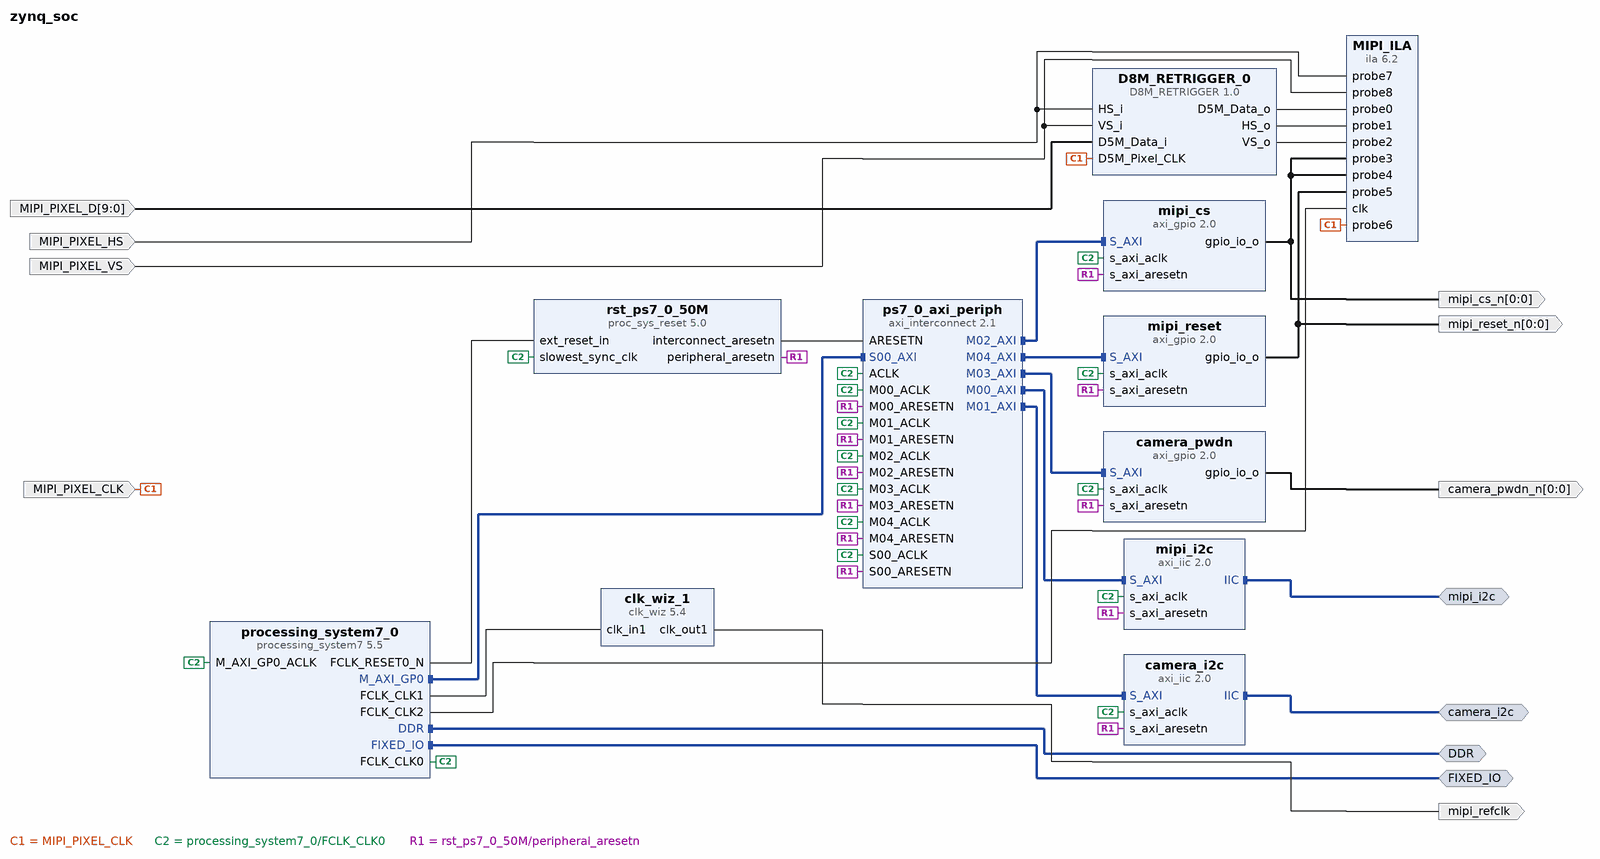
[diagram p0: block diagram of the top level]
# Vivado block design zynq_soc, xc7z020clg484-1, Vivado 2017.2
create_bd_design zynq_soc

create_bd_intf_port -mode Master -vlnv xilinx.com:interface:ddrx_rtl:1.0 DDR
create_bd_intf_port -mode Master -vlnv xilinx.com:display_processing_system7:fixedio_rtl:1.0 FIXED_IO
create_bd_intf_port -mode Master -vlnv xilinx.com:interface:iic_rtl:1.0 camera_i2c
create_bd_intf_port -mode Master -vlnv xilinx.com:interface:iic_rtl:1.0 mipi_i2c
create_bd_port -dir I -type clk MIPI_PIXEL_CLK
create_bd_port -dir I -from 9 -to 0 -type data MIPI_PIXEL_D
create_bd_port -dir I MIPI_PIXEL_HS
create_bd_port -dir I MIPI_PIXEL_VS
create_bd_port -dir O -from 0 -to 0 camera_pwdn_n
create_bd_port -dir O mipi_refclk
create_bd_port -dir O -from 0 -to 0 mipi_cs_n
create_bd_port -dir O -from 0 -to 0 mipi_reset_n

create_bd_cell -type ip -vlnv xilinx.com:user:D8M_RETRIGGER:1.0 D8M_RETRIGGER_0
create_bd_cell -type ip -vlnv xilinx.com:ip:ila:6.2 MIPI_ILA
set_property -dict [list \
  CONFIG.C_PROBE0_WIDTH 12 \
  CONFIG.C_DATA_DEPTH 8192 \
  CONFIG.C_NUM_OF_PROBES 9 \
  CONFIG.C_ENABLE_ILA_AXI_MON false \
  CONFIG.C_MONITOR_TYPE Native \
] [get_bd_cells MIPI_ILA]
create_bd_cell -type ip -vlnv xilinx.com:ip:axi_iic:2.0 camera_i2c
create_bd_cell -type ip -vlnv xilinx.com:ip:axi_gpio:2.0 camera_pwdn
set_property -dict [list \
  CONFIG.C_GPIO_WIDTH 1 \
  CONFIG.C_ALL_INPUTS 0 \
  CONFIG.C_DOUT_DEFAULT 0x00000001 \
  CONFIG.USE_BOARD_FLOW true \
  CONFIG.GPIO_BOARD_INTERFACE Custom \
  CONFIG.C_ALL_OUTPUTS 1 \
] [get_bd_cells camera_pwdn]
create_bd_cell -type ip -vlnv xilinx.com:ip:clk_wiz:5.4 clk_wiz_1
set_property -dict [list \
  CONFIG.PRIM_IN_FREQ 50.000 \
  CONFIG.CLKIN1_JITTER_PS 200.0 \
  CONFIG.CLKOUT1_REQUESTED_OUT_FREQ 20.00 \
  CONFIG.USE_LOCKED false \
  CONFIG.USE_RESET false \
  CONFIG.MMCM_DIVCLK_DIVIDE 1 \
  CONFIG.MMCM_CLKFBOUT_MULT_F 20.000 \
  CONFIG.MMCM_CLKIN1_PERIOD 20.000 \
  CONFIG.MMCM_CLKIN2_PERIOD 10.0 \
  CONFIG.MMCM_CLKOUT0_DIVIDE_F 50.000 \
  CONFIG.USE_BOARD_FLOW true \
  CONFIG.CLK_IN1_BOARD_INTERFACE Custom \
  CONFIG.CLKOUT1_JITTER 249.363 \
  CONFIG.CLKOUT1_PHASE_ERROR 164.985 \
] [get_bd_cells clk_wiz_1]
create_bd_cell -type ip -vlnv xilinx.com:ip:axi_gpio:2.0 mipi_cs
set_property -dict [list \
  CONFIG.C_GPIO_WIDTH 1 \
  CONFIG.C_ALL_INPUTS 0 \
  CONFIG.USE_BOARD_FLOW true \
  CONFIG.GPIO_BOARD_INTERFACE Custom \
  CONFIG.C_ALL_OUTPUTS 1 \
] [get_bd_cells mipi_cs]
create_bd_cell -type ip -vlnv xilinx.com:ip:axi_iic:2.0 mipi_i2c
create_bd_cell -type ip -vlnv xilinx.com:ip:axi_gpio:2.0 mipi_reset
set_property -dict [list \
  CONFIG.C_GPIO_WIDTH 1 \
  CONFIG.C_ALL_INPUTS 0 \
  CONFIG.C_DOUT_DEFAULT 0x00000001 \
  CONFIG.USE_BOARD_FLOW true \
  CONFIG.GPIO_BOARD_INTERFACE Custom \
  CONFIG.C_ALL_OUTPUTS 1 \
] [get_bd_cells mipi_reset]
create_bd_cell -type ip -vlnv xilinx.com:ip:processing_system7:5.5 processing_system7_0
set_property -dict [list \
  CONFIG.PCW_FPGA0_PERIPHERAL_FREQMHZ 50 \
  CONFIG.PCW_FPGA1_PERIPHERAL_FREQMHZ 50 \
  CONFIG.PCW_FPGA2_PERIPHERAL_FREQMHZ 100 \
  CONFIG.PCW_EN_CLK1_PORT 1 \
  CONFIG.PCW_EN_CLK2_PORT 1 \
  CONFIG.PCW_QSPI_GRP_SINGLE_SS_ENABLE 1 \
  CONFIG.PCW_ENET0_PERIPHERAL_ENABLE 0 \
  CONFIG.PCW_USB0_PERIPHERAL_ENABLE 0 \
  CONFIG.preset ZedBoard \
] [get_bd_cells processing_system7_0]
# 2 more settings of processing_system7_0 are not shown: defaults, MIO pin electricals, DDR timing, and values the tool derives
create_bd_cell -type ip -vlnv xilinx.com:ip:axi_interconnect:2.1 ps7_0_axi_periph
set_property -dict {CONFIG.NUM_MI 5} [get_bd_cells ps7_0_axi_periph]
create_bd_cell -type ip -vlnv xilinx.com:ip:proc_sys_reset:5.0 rst_ps7_0_50M

# ---- connections ----

connect_bd_intf_net [get_bd_intf_pins processing_system7_0/M_AXI_GP0] [get_bd_intf_pins ps7_0_axi_periph/S00_AXI]
connect_bd_intf_net [get_bd_intf_pins mipi_i2c/S_AXI] [get_bd_intf_pins ps7_0_axi_periph/M00_AXI]
connect_bd_intf_net [get_bd_intf_pins camera_i2c/S_AXI] [get_bd_intf_pins ps7_0_axi_periph/M01_AXI]
connect_bd_intf_net [get_bd_intf_pins mipi_cs/S_AXI] [get_bd_intf_pins ps7_0_axi_periph/M02_AXI]
connect_bd_intf_net [get_bd_intf_pins camera_pwdn/S_AXI] [get_bd_intf_pins ps7_0_axi_periph/M03_AXI]
connect_bd_intf_net [get_bd_intf_pins mipi_reset/S_AXI] [get_bd_intf_pins ps7_0_axi_periph/M04_AXI]
connect_bd_intf_net [get_bd_intf_ports DDR] [get_bd_intf_pins processing_system7_0/DDR]
connect_bd_intf_net [get_bd_intf_ports FIXED_IO] [get_bd_intf_pins processing_system7_0/FIXED_IO]
connect_bd_intf_net -intf_net axi_iic_0_IIC1 [get_bd_intf_ports camera_i2c] [get_bd_intf_pins camera_i2c/IIC]
connect_bd_intf_net -intf_net axi_iic_0_IIC [get_bd_intf_ports mipi_i2c] [get_bd_intf_pins mipi_i2c/IIC]
connect_bd_net [get_bd_pins D8M_RETRIGGER_0/D5M_Data_o] [get_bd_pins MIPI_ILA/probe0]
connect_bd_net [get_bd_pins D8M_RETRIGGER_0/HS_o] [get_bd_pins MIPI_ILA/probe1]
connect_bd_net [get_bd_pins D8M_RETRIGGER_0/VS_o] [get_bd_pins MIPI_ILA/probe2]
connect_bd_net [get_bd_ports MIPI_PIXEL_CLK] [get_bd_pins D8M_RETRIGGER_0/D5M_Pixel_CLK] [get_bd_pins MIPI_ILA/probe6]
connect_bd_net [get_bd_ports MIPI_PIXEL_D] [get_bd_pins D8M_RETRIGGER_0/D5M_Data_i]
connect_bd_net [get_bd_ports MIPI_PIXEL_HS] [get_bd_pins D8M_RETRIGGER_0/HS_i] [get_bd_pins MIPI_ILA/probe7]
connect_bd_net [get_bd_ports MIPI_PIXEL_VS] [get_bd_pins D8M_RETRIGGER_0/VS_i] [get_bd_pins MIPI_ILA/probe8]
connect_bd_net [get_bd_pins camera_pwdn/gpio_io_o] [get_bd_ports camera_pwdn_n]
connect_bd_net [get_bd_pins clk_wiz_1/clk_out1] [get_bd_ports mipi_refclk]
connect_bd_net [get_bd_pins mipi_cs/gpio_io_o] [get_bd_ports mipi_cs_n] [get_bd_pins MIPI_ILA/probe3] [get_bd_pins MIPI_ILA/probe4]
connect_bd_net [get_bd_pins mipi_reset/gpio_io_o] [get_bd_ports mipi_reset_n] [get_bd_pins MIPI_ILA/probe5]
connect_bd_net [get_bd_pins processing_system7_0/FCLK_CLK2] [get_bd_pins MIPI_ILA/clk]
connect_bd_net [get_bd_pins processing_system7_0/FCLK_CLK0] \
  [get_bd_pins camera_i2c/s_axi_aclk] [get_bd_pins camera_pwdn/s_axi_aclk] [get_bd_pins mipi_cs/s_axi_aclk] \
  [get_bd_pins mipi_i2c/s_axi_aclk] [get_bd_pins mipi_reset/s_axi_aclk] [get_bd_pins processing_system7_0/M_AXI_GP0_ACLK] \
  [get_bd_pins rst_ps7_0_50M/slowest_sync_clk] [get_bd_pins ps7_0_axi_periph/ACLK] [get_bd_pins ps7_0_axi_periph/M00_ACLK] \
  [get_bd_pins ps7_0_axi_periph/M01_ACLK] [get_bd_pins ps7_0_axi_periph/M02_ACLK] [get_bd_pins ps7_0_axi_periph/M03_ACLK] \
  [get_bd_pins ps7_0_axi_periph/M04_ACLK] [get_bd_pins ps7_0_axi_periph/S00_ACLK]
connect_bd_net [get_bd_pins processing_system7_0/FCLK_CLK1] [get_bd_pins clk_wiz_1/clk_in1]
connect_bd_net [get_bd_pins processing_system7_0/FCLK_RESET0_N] [get_bd_pins rst_ps7_0_50M/ext_reset_in]
connect_bd_net [get_bd_pins rst_ps7_0_50M/interconnect_aresetn] [get_bd_pins ps7_0_axi_periph/ARESETN]
connect_bd_net [get_bd_pins rst_ps7_0_50M/peripheral_aresetn] \
  [get_bd_pins camera_i2c/s_axi_aresetn] [get_bd_pins camera_pwdn/s_axi_aresetn] [get_bd_pins mipi_cs/s_axi_aresetn] \
  [get_bd_pins mipi_i2c/s_axi_aresetn] [get_bd_pins mipi_reset/s_axi_aresetn] [get_bd_pins ps7_0_axi_periph/M00_ARESETN] \
  [get_bd_pins ps7_0_axi_periph/M01_ARESETN] [get_bd_pins ps7_0_axi_periph/M02_ARESETN] \
  [get_bd_pins ps7_0_axi_periph/M03_ARESETN] [get_bd_pins ps7_0_axi_periph/M04_ARESETN] \
  [get_bd_pins ps7_0_axi_periph/S00_ARESETN]

# ---- address map ----
assign_bd_address -offset 0x41200000 -range 64K -target_address_space [get_bd_addr_spaces processing_system7_0/Data] [get_bd_addr_segs mipi_cs/S_AXI/Reg]
assign_bd_address -offset 0x41210000 -range 64K -target_address_space [get_bd_addr_spaces processing_system7_0/Data] [get_bd_addr_segs camera_pwdn/S_AXI/Reg]
assign_bd_address -offset 0x41220000 -range 64K -target_address_space [get_bd_addr_spaces processing_system7_0/Data] [get_bd_addr_segs mipi_reset/S_AXI/Reg]
assign_bd_address -offset 0x41600000 -range 64K -target_address_space [get_bd_addr_spaces processing_system7_0/Data] [get_bd_addr_segs mipi_i2c/S_AXI/Reg]
assign_bd_address -offset 0x41610000 -range 64K -target_address_space [get_bd_addr_spaces processing_system7_0/Data] [get_bd_addr_segs camera_i2c/S_AXI/Reg]

validate_bd_design
save_bd_design
